# Altium schematic sheet Car Power Supply v2.SchDoc
size A4
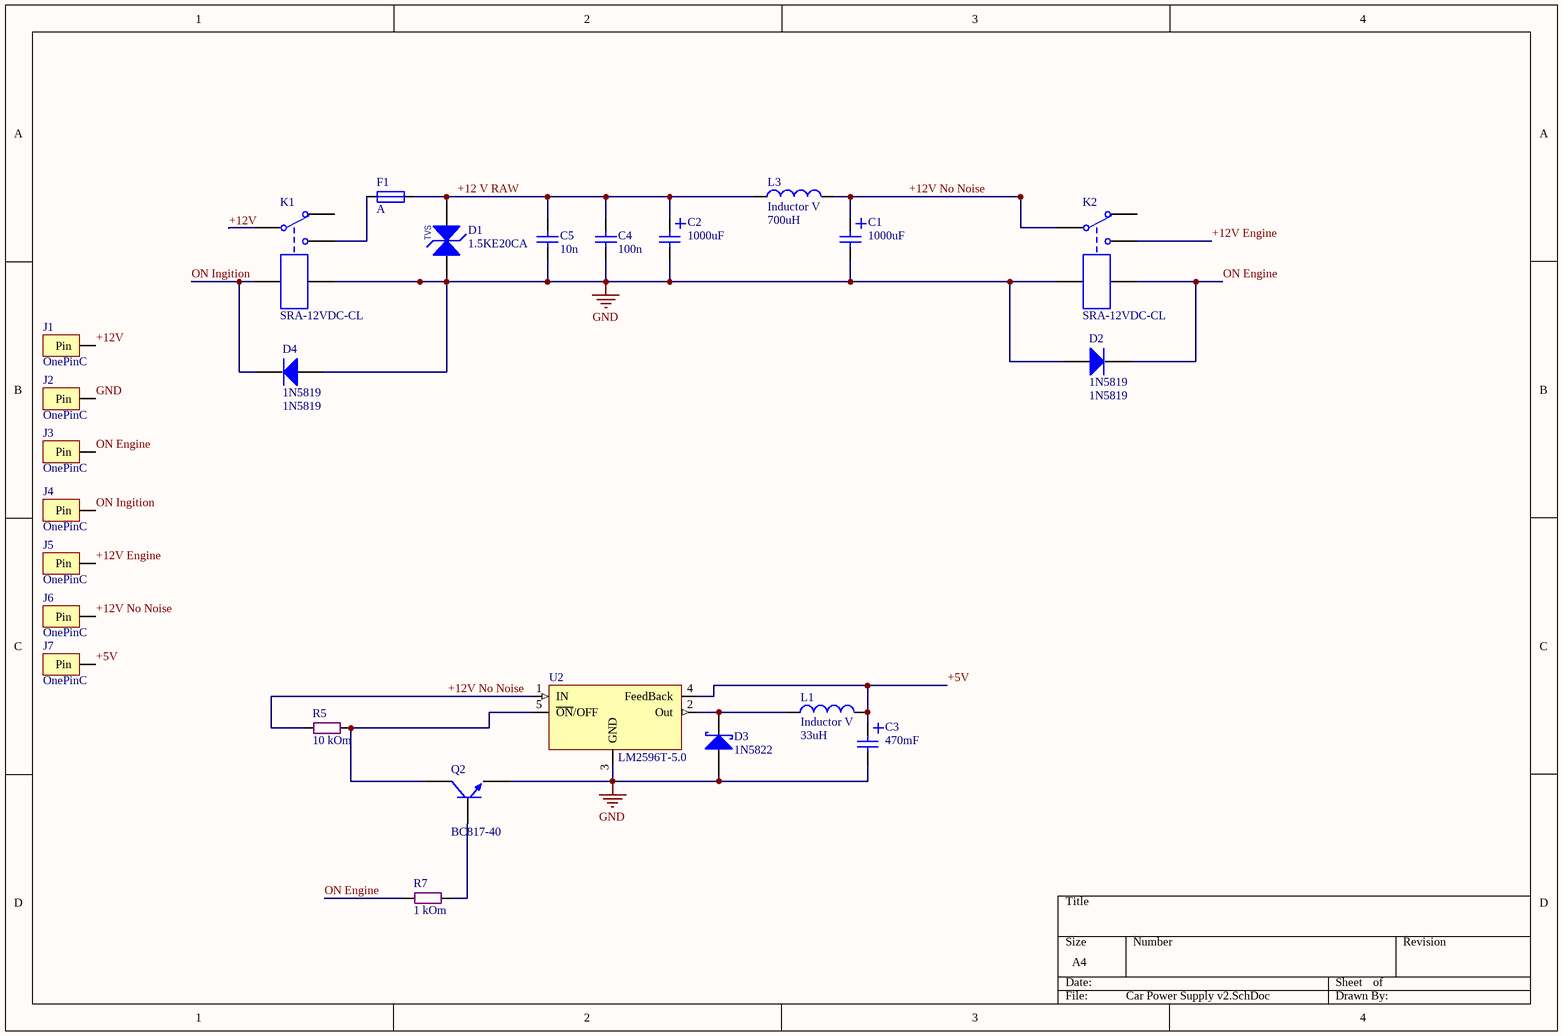
[diagram p0: Car Power Supply v2.SchDoc]

## Parts
C1  1000uF  [Cap E p5.08mm D10.2mm (3p)]
C2  1000uF  [Cap E p5.08mm D10.2mm (3p)]
C3  470mF  [Cap E p5.08mm D10.2mm (3p)]
C4  100n  [Cap P5.08MM (3p) disk2]
C5  10n  [Cap P5.08MM (3p) disk2]
D1  1.5KE20CA  [TVS diode DO-201 V]
D2  1N5819  [Diode DO-35]
D3  1N5822  [Diode DO-201 V]
D4  1N5819  [Diode DO-35]
F1  A  [Fuse RGE1100]
J1  OnePinC  [OnePin 1.2x3]
J2  OnePinC  [OnePin 1.2x3]
J3  OnePinC  [OnePin 1.2x3]
J4  OnePinC  [OnePin 1.2x3]
J5  OnePinC  [OnePin 1.2x3]
J6  OnePinC  [OnePin 1.2x3]
J7  OnePinC  [OnePin 1.2x3]
K1  SRA-12VDC-CL  [SRA-12VDC-CL]
K2  SRA-12VDC-CL  [SRA-12VDC-CL]
L1  Inductor V  value 33uH  [Toroid V D14-W6]
L3  Inductor V  value 700uH  [Toroid V D14-W6]
Q2  BC817-40  [SOT-23]
R5  10 kOm  [Res p7.62 (4p) 0.25w]
R7  1 kOm  [Res p7.62 (4p) 0.25w]
U2  LM2596T-5.0  [TO220-5 Vertical]

## Nets
GND: C1.2 C2.2 C3.2 C4.2 C5.2 D1.1 D2.A D3.A D4.A J2.1(Pin) K1.5 K2.4 Q2.2(E) U2.3(GND)
+5V: C3.1 J7.1(Pin) L1.2 U2.4(FeedBack)
+12 V RAW: C2.1 C4.1 C5.1 D1.2 F1.2 L3.1
+12V: J1.1(Pin) K1.2
+12V Engine: J5.1(Pin) K2.3
+12V No Noise: C1.1 J6.1(Pin) K2.2 L3.2 R5.1 U2.1(IN)
ON Engine: D2.K J3.1(Pin) K2.5 R7.1
ON Ingition: D4.K J4.1(Pin) K1.4
NetD3_K: D3.K L1.1 U2.2(Out)
NetF1_1: F1.1 K1.3
NetQ2_1: Q2.1(B) R7.2
NetQ2_3: Q2.3(C) R5.2 U2.5(~{ON}/OFF)

Not connected (* = marked no-connect by the designer): K1 1; K2 1

## Notes on the sheet
- (in symbol TVS 1.5KE20CA) TVS

## Library data of the parts
C1-C3 = Cap E 1000mF x 25V: Capacitor
C4 C5 = Cap Ceramic: Capacitor
D1 = TVS 1.5KE20CA: 1500W Transil (TVS Diode); Stand-Off V: 17.1; Load A: 5; Breakdown V: min 19 max 21; PackageReference: DO-201; Pulse Power: 1500W; VALUE: 1.5KE20CA
D2 D4 = Diode 1N5819: 1 Amp General Purpose Rectifier; PackageReference: DO-41; VALUE: 1N5819
D3 = D Shotki 1N5822: 3 Amp Shotki  Diode; PackageReference: DO-201; VALUE: 1N5822
F1 = Fuse: Round fuse
J1-J7 = OnePin Connector: Only pad
K1 K2 = SRA-12VDC-CL: Single-Pole Dual-Throw Relay; R обм: 240 Om; I (DC = 30 V): 10A; I (AC = 240 V): 15-20A; U: 12 V; Name: SRA-12VDC-CL; DataSheet: http://tec.org.ru/_bd/12/1208_SRA.pdf
L1 L3 = Inductor V: Inductor Vertical; Code_IEC: 1005; Published: 8-Jun-2000; LatestRevisionDate: 29-May-2009; LatestRevisionNote: IPC-7351 Footprint Added.; PackageReference: 0402-A; Publisher: Altium Limited; PackageDescription: Chip Inductor; Code_JEITA: 0402
Q2 = BC817-40: NPN 45 V, 500 mA NPN general-purpose transistor; type: 45 V, 500 mA NPN general-purpose transistors; Name: BC817-40; url: http://lib.chipdip.ru/156/DOC000156781.pdf
R5 R7 = Res All Types
U2 = LM2596T-5.0: Voltage Regulator; Manufacturer: National Semiconductor; I output (A): 3; Max Voltage In (V): 40; Name: LM2596T-5.0; Case: TO220-5